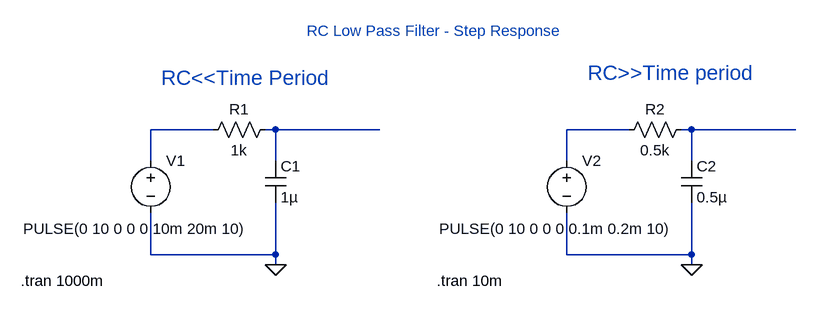
[diagram p0: schematic Low Pass RC circuit.asc]
Low Pass RC circuit.asc, the LTspice schematic file:
Version 4
SHEET 1 1044 680
WIRE 144 64 48 64
WIRE 240 64 224 64
WIRE 400 64 240 64
WIRE 784 64 688 64
WIRE 880 64 864 64
WIRE 1040 64 880 64
WIRE 48 112 48 64
WIRE 240 112 240 64
WIRE 688 112 688 64
WIRE 880 112 880 64
WIRE 48 256 48 192
WIRE 240 256 240 176
WIRE 240 256 48 256
WIRE 688 256 688 192
WIRE 880 256 880 176
WIRE 880 256 688 256
WIRE 240 272 240 256
WIRE 880 272 880 256
FLAG 240 272 0
FLAG 880 272 0
SYMBOL voltage 48 96 R0
WINDOW 3 -196 120 Left 2
WINDOW 123 0 0 Left 0
WINDOW 39 0 0 Left 0
SYMATTR Value PULSE(0 10 0 0 0 10m 20m 10)
SYMATTR InstName V1
SYMBOL cap 224 112 R0
SYMATTR InstName C1
SYMATTR Value 1µ
SYMBOL res 240 48 R90
WINDOW 0 0 56 VBottom 2
WINDOW 3 32 56 VTop 2
SYMATTR InstName R1
SYMATTR Value 1k
SYMBOL voltage 688 96 R0
WINDOW 3 -196 120 Left 2
WINDOW 123 0 0 Left 0
WINDOW 39 0 0 Left 0
SYMATTR Value PULSE(0 10 0 0 0 0.1m 0.2m 10)
SYMATTR InstName V2
SYMBOL cap 864 112 R0
SYMATTR InstName C2
SYMATTR Value 0.5µ
SYMBOL res 880 48 R90
WINDOW 0 0 56 VBottom 2
WINDOW 3 32 56 VTop 2
SYMATTR InstName R2
SYMATTR Value 0.5k
TEXT -152 296 Left 2 !.tran 1000m
TEXT 488 296 Left 2 !.tran 10m
TEXT 720 -24 Left 3 ;RC>>Time period
TEXT 64 -16 Left 3 ;RC<<Time Period
TEXT 288 -88 Left 2 ;RC Low Pass Filter - Step Response

The netlist it stands for:
* Low Pass RC circuit.asc
V1 N001 0 PULSE(0 10 0 0 0 10m 20m 10)
C1 N002 0 1µ
R1 N002 N001 1k
V2 N003 0 PULSE(0 10 0 0 0 0.1m 0.2m 10)
C2 N004 0 0.5µ
R2 N004 N003 0.5k
.tran 1000m
.tran 10m
* RC>>Time period
* RC<<Time Period
* RC Low Pass Filter - Step Response
.backanno
.end